# Altium schematic sheet Overview.SchDoc
size A3; Organization: MCI; SheetNumber: 1; SheetTotal: 1
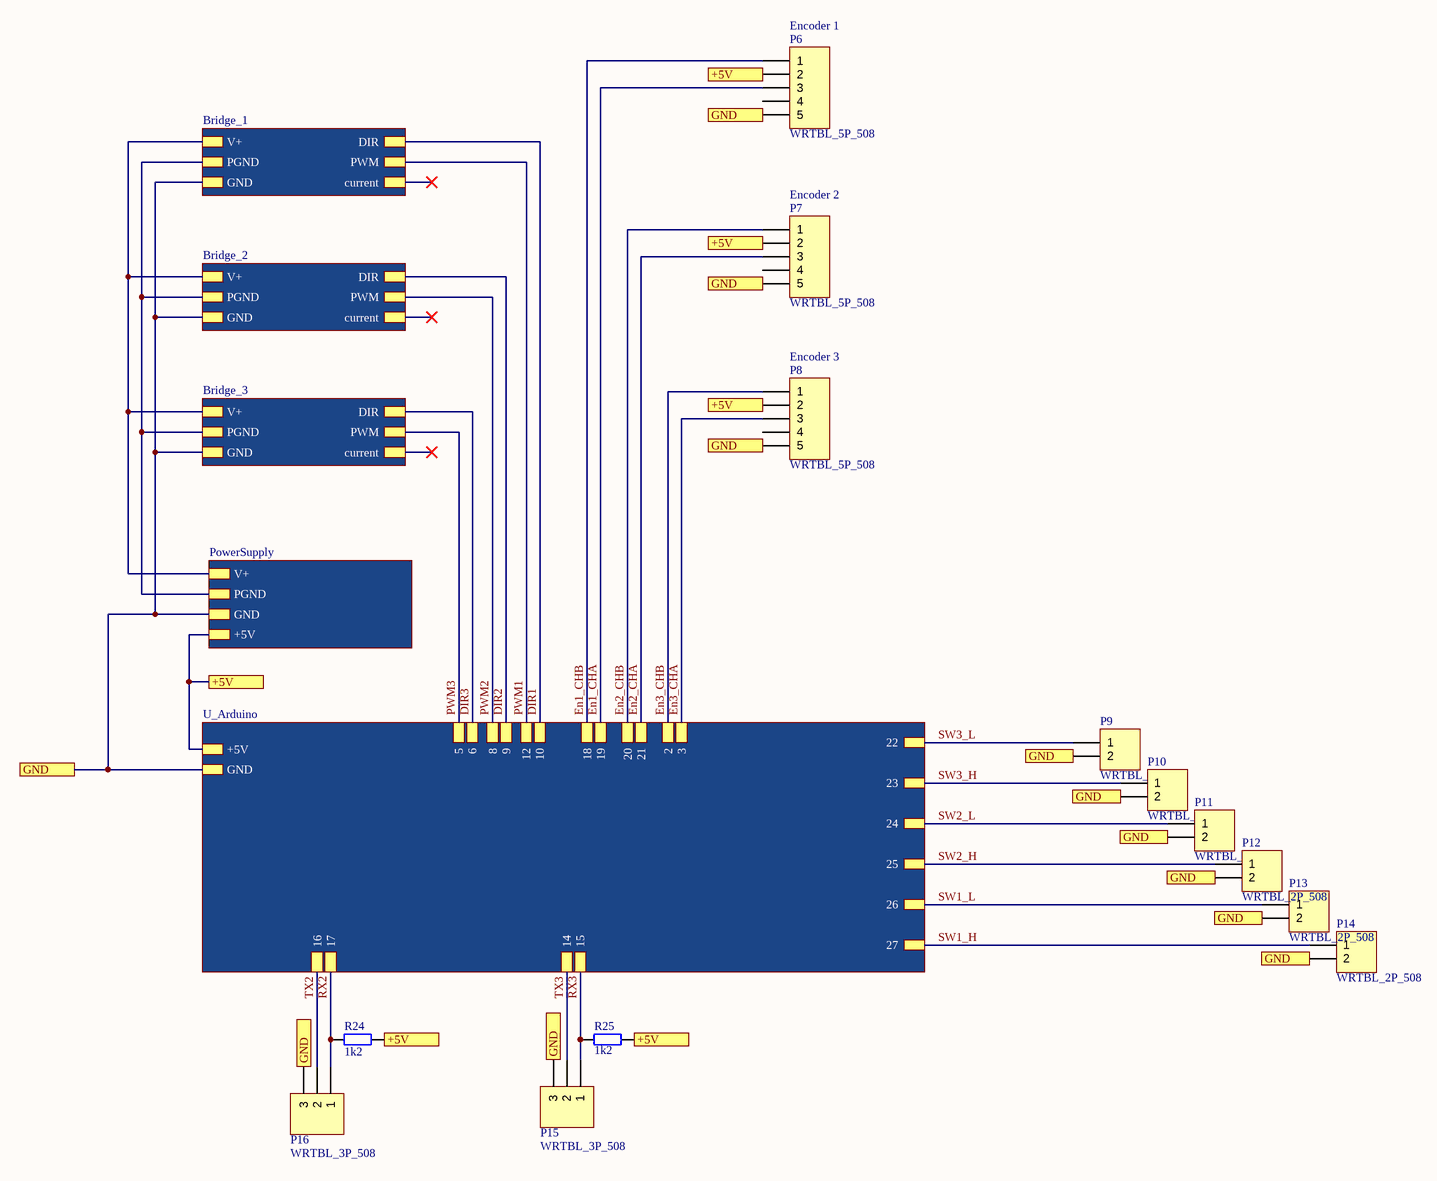
[diagram p0: Overview.SchDoc]

## Parts
P6  WRTBL_5P_508  [WRTBL_5P_508]
P7  WRTBL_5P_508  [WRTBL_5P_508]
P8  WRTBL_5P_508  [WRTBL_5P_508]
P9  WRTBL_2P_508  [WRTBL_2P_508]
P10  WRTBL_2P_508  [WRTBL_2P_508]
P11  WRTBL_2P_508  [WRTBL_2P_508]
P12  WRTBL_2P_508  [WRTBL_2P_508]
P13  WRTBL_2P_508  [WRTBL_2P_508]
P14  WRTBL_2P_508  [WRTBL_2P_508]
P15  WRTBL_3P_508  [WRTBL_3P_508]
P16  WRTBL_3P_508  [WRTBL_3P_508]
R24  1k2  [_0603]
R25  1k2  [_0603]

## Sub-sheets
Bridge_1 = OutputStage.SchDoc: DIR, PWM, current, V+, PGND, GND
Bridge_2 = OutputStage.SchDoc: DIR, PWM, current, V+, PGND, GND
Bridge_3 = OutputStage.SchDoc: DIR, PWM, current, V+, PGND, GND
PowerSupply = PowerSupply.SchDoc: V+, +5V, GND, PGND
U_Arduino = Arduino.SchDoc: +5V, GND, 16, 17, 9, 12, 23, 2, 10, 8, 15, 3, 26, 25, 19, 24, 18, 27, 6, 22, 20, 5, 21, 14

## Ports
+5V, GND

## Nets
+5V: P6.2 P7.2 P8.2 R24.2 R25.2 ; port +5V, sheet PowerSupply/+5V, sheet U_Arduino/+5V
DIR1: sheet Bridge_1/DIR, sheet U_Arduino/10
DIR2: sheet Bridge_2/DIR, sheet U_Arduino/9
DIR3: sheet Bridge_3/DIR, sheet U_Arduino/6
En1_CHA: P6.3 ; sheet U_Arduino/19
En1_CHB: P6.1 ; sheet U_Arduino/18
En2_CHA: P7.3 ; sheet U_Arduino/21
En2_CHB: P7.1 ; sheet U_Arduino/20
En3_CHA: P8.3 ; sheet U_Arduino/3
En3_CHB: P8.1 ; sheet U_Arduino/2
GND: P6.5 P7.5 P8.5 P9.2 P10.2 P11.2 P12.2 P13.2 P14.2 P15.3 P16.3 ; port GND, sheet PowerSupply/GND, sheet Bridge_1/GND, sheet Bridge_2/GND, sheet Bridge_3/GND, sheet U_Arduino/GND
PWM1: sheet Bridge_1/PWM, sheet U_Arduino/12
PWM2: sheet Bridge_2/PWM, sheet U_Arduino/8
PWM3: sheet Bridge_3/PWM, sheet U_Arduino/5
RX2: P16.1 R24.1 ; sheet U_Arduino/17
RX3: P15.1 R25.1 ; sheet U_Arduino/15
SW1_H: P14.1 ; sheet U_Arduino/27
SW1_L: P13.1 ; sheet U_Arduino/26
SW2_H: P12.1 ; sheet U_Arduino/25
SW2_L: P11.1 ; sheet U_Arduino/24
SW3_H: P10.1 ; sheet U_Arduino/23
SW3_L: P9.1 ; sheet U_Arduino/22
TX2: P16.2 ; sheet U_Arduino/16
TX3: P15.2 ; sheet U_Arduino/14
(unnamed): sheet PowerSupply/V+, sheet Bridge_1/V+, sheet Bridge_2/V+, sheet Bridge_3/V+
(unnamed): sheet PowerSupply/PGND, sheet Bridge_1/PGND, sheet Bridge_2/PGND, sheet Bridge_3/PGND

Not connected (* = marked no-connect by the designer): P6 4; P7 4; P8 4

## Notes on the sheet
- (near P6) Encoder 1
- (near P7) Encoder 2
- (near P8) Encoder 3
- Project
- Date:
- Drawn by:
- Time:
- Number:
- Revision:
- Sheet
- of
- ELECTRONICS
- File:

## Library data of the parts
P6-P8 = Con_10: QR: 0; UID: Con_10; Name: WRTBL_5P_508; mounting: THT; Pins: 5
P9-P14 = Con_7: RS_number: 193-0586; QR: 0; UID: Con_7; Name: WRTBL_2P_508; Name_Hyperlink: Printklemme 5,08mm 2-polig; ComponentLink1URL: http://at.rs-online.com/web/search/searchBrowseAction.html?method=getProduct&R=1930586; mounting: THT; Pins: 2
P15 P16 = Con_8: QR: 0; UID: Con_8; Name: WRTBL_3P_508; mounting: THT; Pins: 3
R24 R25 = Res_5: Name: Res_0603; UID: Res_5; ComponentLink1URL: #VALUE!; mounting: SMD